# Altium schematic sheet rectifiers.SchDoc
size A3; SPICEModelCacheBAFMZODH: <root> / <DocumentId>BAFMZODH</DocumentId> / <CacheFrame Number="0"> / <Model Name="tl084" Kind="CKT"> / <Text>*TL084 / *Quad JFETInput OpAmp pkg:DIP14 (A:3,2,4,11,1)(B:5,6,4,11,7)(C:10,9,4,11,8)(D:12,13,4,11,14) / * Connections: / *             Non-Inverting Input / *             | Inverting Input / *             | | Positive Power Supply / *             | | | Negative Power Supply / *             | | | | Output / *             | | | | | / .SUBCKT TL084 1 2 3 4 5 / C1   11 12 3.498E-12 / C2    6  7 15E-12 / DC    5 53 DX / DE   54  5 DX / DLP  90 91 DX / DLN  92 90 DX / DP    4  3 DX / BGND 99  0 V=V(3)*.5 + V(4)*.5 / BB    7 99 I=I(VB)*4.715E6 - I(VC)*5E6 + I(VE)*5E6 + / +              I(VLP)*5E6 - I(VLN)*5E6 / GA    6  0 11 12 282.8E-6 / GCM   0  6 10 99 8.942E-9 / ISS   3 10 DC 195E-6 / HLIM 90  0 VLIM 1K / J1   11  2 10 JX / J2   12  1 10 JX / R2    6  9 100E3 / RD1   4 11 3.536E3 / RD2   4 12 3.536E3 / RO1   8  5 150 / RO2   7 99 150 / RP    3  4 2.143E3 / RSS  10 99 1.026E6 / VB    9  0 DC 0 / VC    3 53 DC 2.2 / VE   54  4 DC 2.2 / VLIM  7  8 DC 0 / VLP  91  0 DC 25 / VLN   0 92 DC 25 / .MODEL DX D(IS=800E-18) / .MODEL JX PJF(IS=15E-12 BETA=270.1E-6 VTO=-1) / .ENDS TL084</Text> / </Model> / </CacheFrame> / </root>
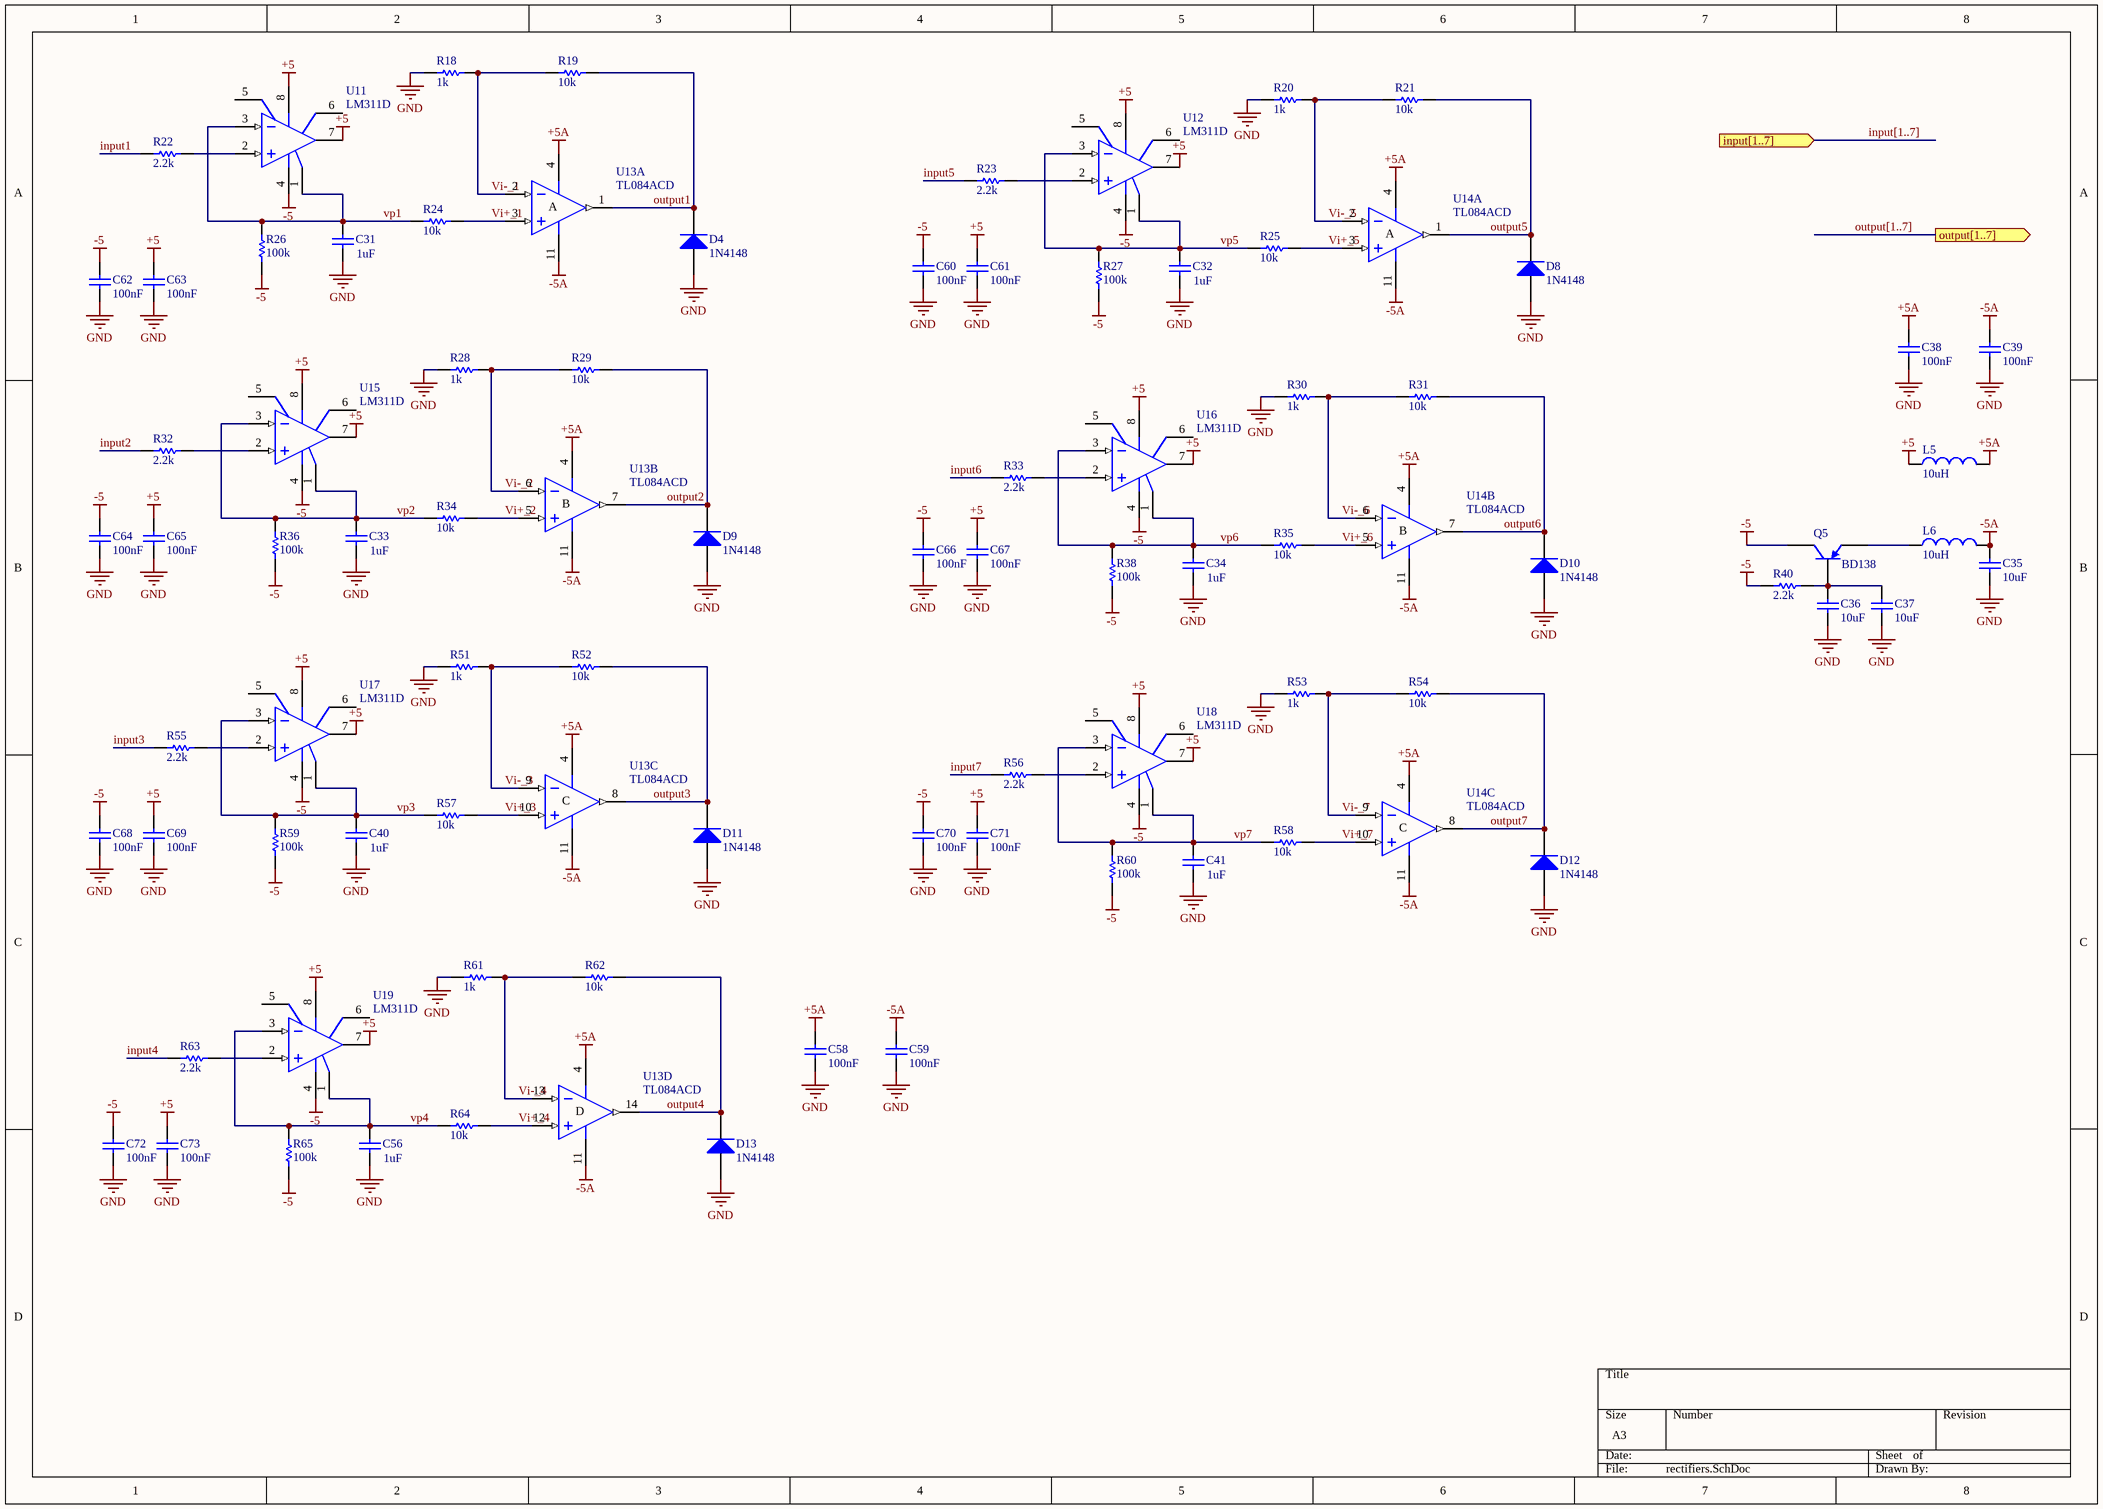
[diagram p0: rectifiers.SchDoc]

## Parts
C31  1uF  [SMD_CAP_0805]
C32  1uF  [SMD_CAP_0805]
C33  1uF  [SMD_CAP_0805]
C34  1uF  [SMD_CAP_0805]
C35  10uF  [SMD_CAP_0805]
C36  10uF  [SMD_CAP_0805]
C37  10uF  [SMD_CAP_0805]
C38  100nF  [SMD_CAP_0805]
C39  100nF  [SMD_CAP_0805]
C40  1uF  [SMD_CAP_0805]
C41  1uF  [SMD_CAP_0805]
C56  1uF  [SMD_CAP_0805]
C58  100nF  [SMD_CAP_0805]
C59  100nF  [SMD_CAP_0805]
C60  100nF  [SMD_CAP_0805]
C61  100nF  [SMD_CAP_0805]
C62  100nF  [SMD_CAP_0805]
C63  100nF  [SMD_CAP_0805]
C64  100nF  [SMD_CAP_0805]
C65  100nF  [SMD_CAP_0805]
C66  100nF  [SMD_CAP_0805]
C67  100nF  [SMD_CAP_0805]
C68  100nF  [SMD_CAP_0805]
C69  100nF  [SMD_CAP_0805]
C70  100nF  [SMD_CAP_0805]
C71  100nF  [SMD_CAP_0805]
C72  100nF  [SMD_CAP_0805]
C73  100nF  [SMD_CAP_0805]
D4  1N4148  [LL4148]
D8  1N4148  [LL4148]
D9  1N4148  [LL4148]
D10  1N4148  [LL4148]
D11  1N4148  [LL4148]
D12  1N4148  [LL4148]
D13  1N4148  [LL4148]
L5  value 10uH  [IND1206]  (hidden comment: inductor 10uH)
L6  value 10uH  [IND1206]  (hidden comment: inductor 10uH)
Q5  BD138  [SOT-32]
R18  1k  [RES 0805 (2012X06L)]
R19  10k  [RES 0805 (2012X06L)]
R20  1k  [RES 0805 (2012X06L)]
R21  10k  [RES 0805 (2012X06L)]
R22  2.2k  [RES 0805 (2012X06L)]
R23  2.2k  [RES 0805 (2012X06L)]
R24  10k  [RES 0805 (2012X06L)]
R25  10k  [RES 0805 (2012X06L)]
R26  100k  [RES 0805 (2012X06L)]
R27  100k  [RES 0805 (2012X06L)]
R28  1k  [RES 0805 (2012X06L)]
R29  10k  [RES 0805 (2012X06L)]
R30  1k  [RES 0805 (2012X06L)]
R31  10k  [RES 0805 (2012X06L)]
R32  2.2k  [RES 0805 (2012X06L)]
R33  2.2k  [RES 0805 (2012X06L)]
R34  10k  [RES 0805 (2012X06L)]
R35  10k  [RES 0805 (2012X06L)]
R36  100k  [RES 0805 (2012X06L)]
R38  100k  [RES 0805 (2012X06L)]
R40  2.2k  [RES 0805 (2012X06L)]
R51  1k  [RES 0805 (2012X06L)]
R52  10k  [RES 0805 (2012X06L)]
R53  1k  [RES 0805 (2012X06L)]
R54  10k  [RES 0805 (2012X06L)]
R55  2.2k  [RES 0805 (2012X06L)]
R56  2.2k  [RES 0805 (2012X06L)]
R57  10k  [RES 0805 (2012X06L)]
R58  10k  [RES 0805 (2012X06L)]
R59  100k  [RES 0805 (2012X06L)]
R60  100k  [RES 0805 (2012X06L)]
R61  1k  [RES 0805 (2012X06L)]
R62  10k  [RES 0805 (2012X06L)]
R63  2.2k  [RES 0805 (2012X06L)]
R64  10k  [RES 0805 (2012X06L)]
R65  100k  [RES 0805 (2012X06L)]
U11  LM311D  [SO8_N]
U12  LM311D  [SO8_N]
U13  TL084ACD  [SO14_N]  (parts A,B,C,D of 4)
U14  TL084ACD  [SO14_N]  (parts A,B,C of 4)
U15  LM311D  [SO8_N]
U16  LM311D  [SO8_N]
U17  LM311D  [SO8_N]
U18  LM311D  [SO8_N]
U19  LM311D  [SO8_N]

## Ports
input[1..7] (in), output[1..7] (out)

## Nets
+5: C61.2 C63.2 C65.2 C67.2 C69.2 C71.2 C73.2 L5.1 U11.7(OUT) U11.8(V+) U12.7(OUT) U12.8(V+) U15.7(OUT) U15.8(V+) U16.7(OUT) U16.8(V+) U17.7(OUT) U17.8(V+) U18.7(OUT) U18.8(V+) U19.7(OUT) U19.8(V+)
+5A: C38.2 C58.2 L5.2 U13.4(V+) U14.4(V+)
-5: C60.2 C62.2 C64.2 C66.2 C68.2 C70.2 C72.2 Q5.C R26.2 R27.2 R36.2 R38.2 R40.2 R59.2 R60.2 R65.2 U11.4(V-_(CASE)) U12.4(V-_(CASE)) U15.4(V-_(CASE)) U16.4(V-_(CASE)) U17.4(V-_(CASE)) U18.4(V-_(CASE)) U19.4(V-_(CASE))
-5A: C35.2 C39.2 C59.2 L6.2 U13.11(V-) U14.11(V-)
GND: C31.1 C32.1 C33.1 C34.1 C35.1 C36.1 C37.1 C38.1 C39.1 C40.1 C41.1 C56.1 C58.1 C59.1 C60.1 C61.1 C62.1 C63.1 C64.1 C65.1 C66.1 C67.1 C68.1 C69.1 C70.1 C71.1 C72.1 C73.1 D4.1(A) D8.1(A) D9.1(A) D10.1(A) D11.1(A) D12.1(A) D13.1(A) R18.2 R20.2 R28.2 R30.2 R51.2 R53.2 R61.2
input1: R22.2
input2: R32.2
input3: R55.2
input4: R63.2
input5: R23.2
input6: R33.2
input7: R56.2
output1: D4.2(K) R19.1 U13.1(OUT)
output2: D9.2(K) R29.1 U13.7(OUT)
output3: D11.2(K) R52.1 U13.8(OUT)
output4: D13.2(K) R62.1 U13.14(OUT)
output5: D8.2(K) R21.1 U14.1(OUT)
output6: D10.2(K) R31.1 U14.7(OUT)
output7: D12.2(K) R54.1 U14.8(OUT)
Vi+_1: R24.1 U13.3(IN+)
Vi+_2: R34.1 U13.5(IN+)
Vi+_3: R57.1 U13.10(IN+)
Vi+_4: R64.1 U13.12(IN+)
Vi+_5: R25.1 U14.3(IN+)
Vi+_6: R35.1 U14.5(IN+)
Vi+_7: R58.1 U14.10(IN+)
Vi-_1: R18.1 R19.2 U13.2(IN-)
Vi-_2: R28.1 R29.2 U13.6(IN-)
Vi-_3: R51.1 R52.2 U13.9(IN-)
Vi-_4: R61.1 R62.2 U13.13(IN-)
Vi-_5: R20.1 R21.2 U14.2(IN-)
Vi-_6: R30.1 R31.2 U14.6(IN-)
Vi-_7: R53.1 R54.2 U14.9(IN-)
vp1: C31.2 R24.2 R26.1 U11.1(GND) U11.3(IN-)
vp2: C33.2 R34.2 R36.1 U15.1(GND) U15.3(IN-)
vp3: C40.2 R57.2 R59.1 U17.1(GND) U17.3(IN-)
vp4: C56.2 R64.2 R65.1 U19.1(GND) U19.3(IN-)
vp5: C32.2 R25.2 R27.1 U12.1(GND) U12.3(IN-)
vp6: C34.2 R35.2 R38.1 U16.1(GND) U16.3(IN-)
vp7: C41.2 R58.2 R60.1 U18.1(GND) U18.3(IN-)
NetC36_2: C36.2 C37.2 Q5.B R40.1
NetL6_1: L6.1 Q5.E
NetR22_1: R22.1 U11.2(IN+)
NetR23_1: R23.1 U12.2(IN+)
NetR32_1: R32.1 U15.2(IN+)
NetR33_1: R33.1 U16.2(IN+)
NetR55_1: R55.1 U17.2(IN+)
NetR56_1: R56.1 U18.2(IN+)
NetR63_1: R63.1 U19.2(IN+)

Not connected (* = marked no-connect by the designer): U11 5(BAL) 6(BAL/STB); U12 5(BAL) 6(BAL/STB); U15 5(BAL) 6(BAL/STB); U16 5(BAL) 6(BAL/STB); U17 5(BAL) 6(BAL/STB); U18 5(BAL) 6(BAL/STB); U19 5(BAL) 6(BAL/STB)

## Buses and harness runs
bus input[1..7] = port input[1..7]
bus output[1..7] = port output[1..7]

## Notes on the sheet
- (in symbol TL084ACD, part A) A
- (in symbol TL084ACD, part B) B
- (in symbol TL084ACD, part C) C
- (in symbol TL084ACD, part D) D

## Library data of the parts
C31-C41 C56 C58-C73 = Cap ceramic: CAP-100Nf
  C31-C34 C40 C41 C56: Value: 1uF
  C35-C37: Value: 10uF
  C38 C39 C58-C73: Value: 100nF
D4 D8-D13 = Diode 1N4148: High Conductance Fast Diode; Published: 8-Jun-2000; LatestRevisionDate: 17-Jul-2002; LatestRevisionNote: Re-released for DXP Platform.; DatasheetVersion: 1997; PackageReference: DO-35; Publisher: Altium Limited; PackageDescription: Diode, Axial; Body 3.8 x 1.9 mm (LxDia. max), Lead Dia. 0.53 mm (max); Code_JEDEC: DO-204-AH; ComponentLink1Description: Manufacturer Link; ComponentLink1URL: http://www.fairchildsemi.com/; ComponentLink2Description: Datasheet; ComponentLink2URL: http://www.fairchildsemi.com/ds/1N%2F1N4148.pdf
L5 L6 = Inductor: Code_IEC: 1005; Published: 8-Jun-2000; LatestRevisionDate: 29-May-2009; LatestRevisionNote: IPC-7351 Footprint Added.; PackageReference: 0402-A; Publisher: Altium Limited; PackageDescription: Chip Inductor; Code_JEITA: 0402
Q5 = BD138: PNP Transistor; E-mail: picpars@gmail.com; De: Seyed Mohsen Ghasemian; web: www.picpars.com
R18-R36 R38 R40 R51-R65 = Res1: Resistor; Published: 8-Jun-2000; LatestRevisionDate: 17-Jul-2002; LatestRevisionNote: Re-released for DXP Platform.; PackageReference: AXIAL-0.3; Publisher: Altium Limited; PackageDescription: Axial Device, Thru-Hole; 2 Leads; 0.3 in Pin Spacing
  R18 R20 R28 R30 R51 R53 R61: Value: 1k
  R19 R21 R24 R25 R29 R31 R34 R35 R52 R54 R57 R58 R62 R64: Value: 10k
  R22 R23 R32 R33 R40 R55 R56 R63: Value: 2.2k
  R26 R27 R36 R38 R59 R60 R65: Value: 100k
U11 U12 U15-U19 = LM311D: Voltage Comparator; Published: 24-Aug-2001; LatestRevisionDate: 13-Apr-2006; LatestRevisionNote: IPC-7351 Footprint Added.; DatasheetVersion: Oct-1997; PackageVersion: Dec-2002; PackageReference: SO8; Publisher: Altium Limited; PackageDescription: 8-Pin Small Outline Integrated Circuit 1.27 mm Pitch; Code_JEDEC: MS-012-AA; Code_IPC: SOIC127P600-8; ComponentLink1Description: Manufacturer Link; ComponentLink1URL: http://www.st.com/; ComponentLink2Description: Datasheet; ComponentLink2URL: http://www.st.com/stonline/products/literature/ds/4848/lm211.pdf
U13 U14 = TL084ACD: General-Purpose J-FET Quad Operational Amplifier; Published: 24-Aug-2001; LatestRevisionDate: 13-Apr-2006; LatestRevisionNote: IPC-7351 Footprint Added.; DatasheetVersion: Jan-1999; PackageVersion: Sep-1998; PackageReference: SO14; Publisher: Altium Limited; PackageDescription: 14-Pin Small Outline Integrated Circuit 1.27 mm Pitch; Code_IPC: SOIC127P600-14; ComponentLink1Description: Manufacturer Link; ComponentLink1URL: http://www.st.com/; ComponentLink2Description: Datasheet; ComponentLink2URL: http://www.st.com/stonline/products/literature/ds/2301/tl084.pdf